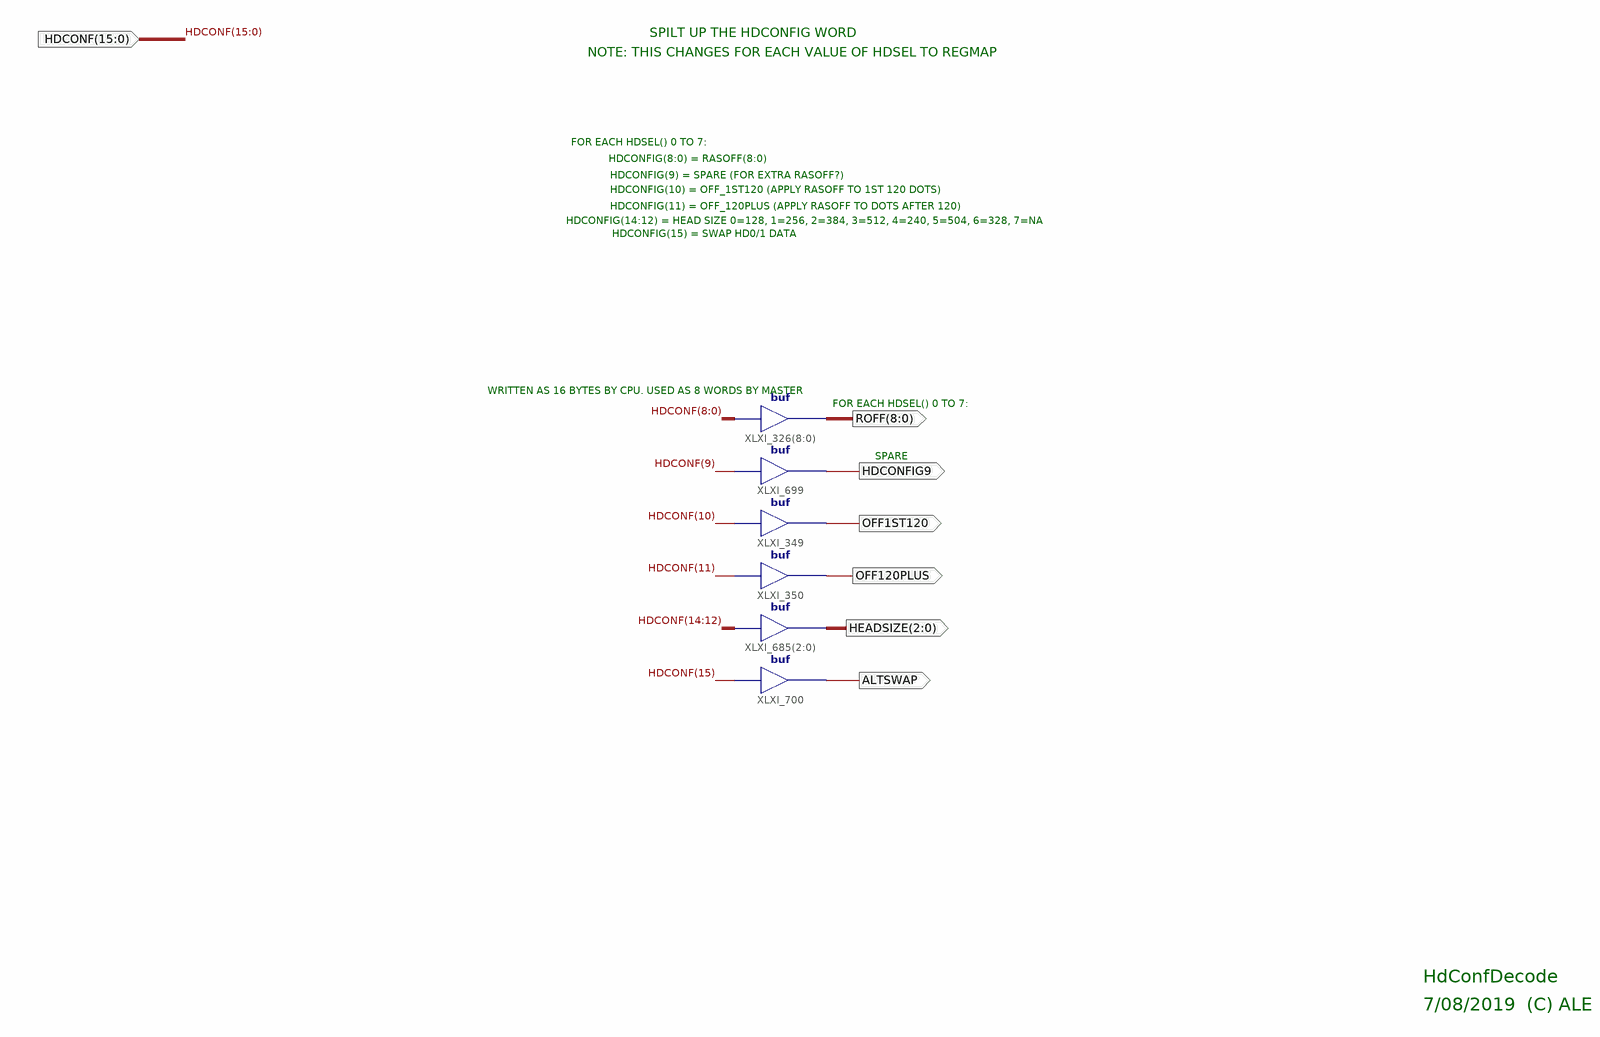
[diagram p0: schematic sheet 1]
// Xilinx ISE schematic HdConfDecode.sch (zynq) as structural Verilog: 6 symbols, 7 ports
module HdConfDecode (
  input  [15:0] HDCONF,
  output [8:0] ROFF,
  output OFF1ST120,
  output OFF120PLUS,
  output [2:0] HEADSIZE,
  output HDCONFIG9,
  output ALTSWAP
);

  assign ROFF = HDCONF[8:0];  // buf XLXI_326[8..0], 9 bits wide
  buf XLXI_349 (OFF1ST120, HDCONF[10]);
  buf XLXI_350 (OFF120PLUS, HDCONF[11]);
  assign HEADSIZE = HDCONF[14:12];  // buf XLXI_685[2..0], 3 bits wide
  buf XLXI_699 (HDCONFIG9, HDCONF[9]);
  buf XLXI_700 (ALTSWAP, HDCONF[15]);

  // Notes on the sheet:
  //   SPILT UP THE HDCONFIG WORD
  //   NOTE: THIS CHANGES FOR EACH VALUE OF HDSEL TO REGMAP
  //   FOR EACH HDSEL() 0 TO 7:
  //   HDCONFIG(8:0) = RASOFF(8:0)
  //   HDCONFIG(9) = SPARE (FOR EXTRA RASOFF?)
  //   HDCONFIG(10) = OFF_1ST120 (APPLY RASOFF TO 1ST 120 DOTS)
  //   HDCONFIG(11) = OFF_120PLUS (APPLY RASOFF TO DOTS AFTER 120)
  //   HDCONFIG(14:12) = HEAD SIZE 0=128, 1=256, 2=384, 3=512, 4=240, 5=504, 6=328, 7=NA
  //   HDCONFIG(15) = SWAP HD0/1 DATA
  //   WRITTEN AS 16 BYTES BY CPU. USED AS 8 WORDS BY MASTER
  //   FOR EACH HDSEL() 0 TO 7:
  //   SPARE
  //   HdConfDecode
  //   7/08/2019  (C) ALE
endmodule
